# Altium schematic sheet pca20054_sheet1_cover.SchDoc: PCA20054 - Cover
size A3; Organization: Nordic Semiconductor; DocumentNumber: 1; Revision: 1.0.0; SheetNumber: 1; SheetTotal: 5; Date: 2020-02-07; CompanyName: Nordic Semiconductor; DrawnBy: KJP; ProjectNumber: 4467
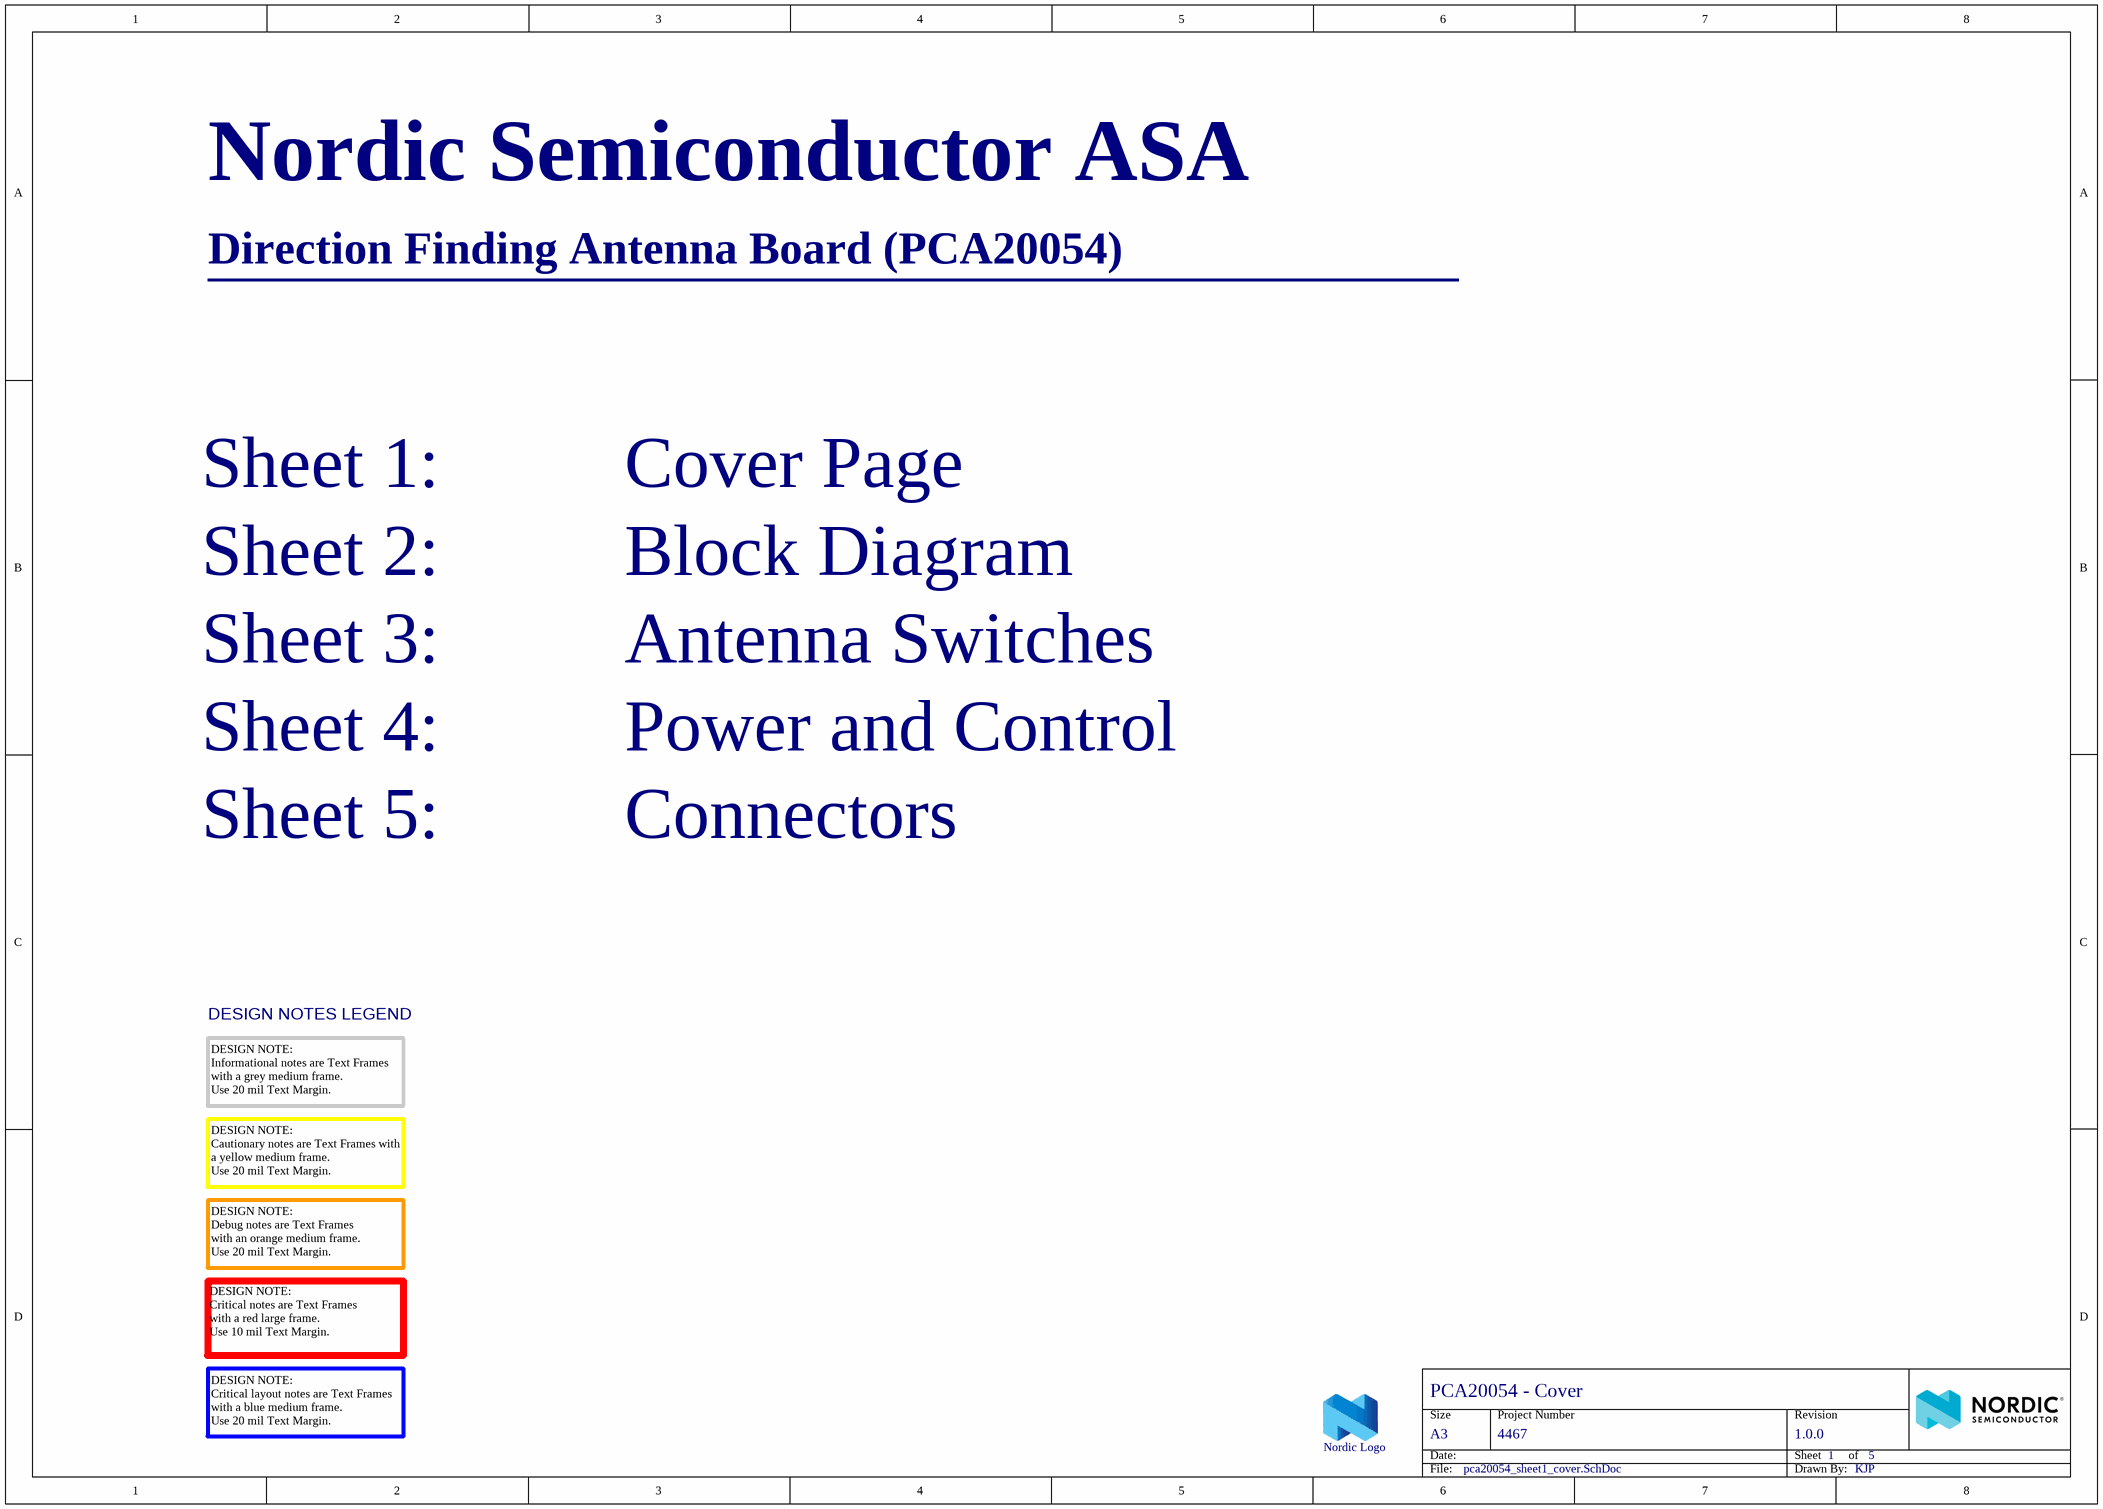
[diagram p0: pca20054_sheet1_cover.SchDoc]

## Parts
LOGO?  Nordic Logo  [NORDIC_LOGO_LYING]  (no BOM)

## Notes on the sheet
- Nordic Semiconductor ASA
- Direction Finding Antenna Board (PCA20054)
- _________________________________________
- Sheet 1:          Cover Page
- Sheet 2:          Block Diagram
- Sheet 3:          Antenna Switches
- Sheet 4:          Power and Control
- Sheet 5:          Connectors
- DESIGN NOTES LEGEND
- DESIGN NOTE:
  Informational notes are Text Frames with a grey medium frame.
  Use 20 mil Text Margin.
- DESIGN NOTE:
  Cautionary notes are Text Frames with a yellow medium frame.
  Use 20 mil Text Margin.
- DESIGN NOTE:
  Debug notes are Text Frames
  with an orange medium frame.
  Use 20 mil Text Margin.
- DESIGN NOTE:
  Critical notes are Text Frames
  with a red large frame.
  Use 10 mil Text Margin.
- DESIGN NOTE:
  Critical layout notes are Text Frames
  with a blue medium frame.
  Use 20 mil Text Margin.
- Size
- Date:
- A3
- Project Number
- Sheet         of
- Revision
- File:
- Drawn By:

## Library data of the parts
LOGO? = Nordic Logo lying: Artikkelnr Noca: N.A.; Part Number: Nordic Logo lying; Manufacturer: *; Manufacturer Part Number: *; ComponentLink1URL: *; ComponentLink1Description: Datasheet; ComponentLink2URL: *; ComponentLink2Description: Supplier link; HelpURL: *; Footprint Doc: Nordic Logo; LatestRevisionDate: 2017-03-20; Pin Count: 0; Publisher: Nordic Semiconductor; Published: 2017-09-01; Value: Nordic Logo; Note: *; Supplier 1: *; Supplier Part Number 1: *; Supplier 2: *; Supplier Part Number 2: *; Part number IPS: N.A.